# EAGLE design trans (EAGLE 5.00)
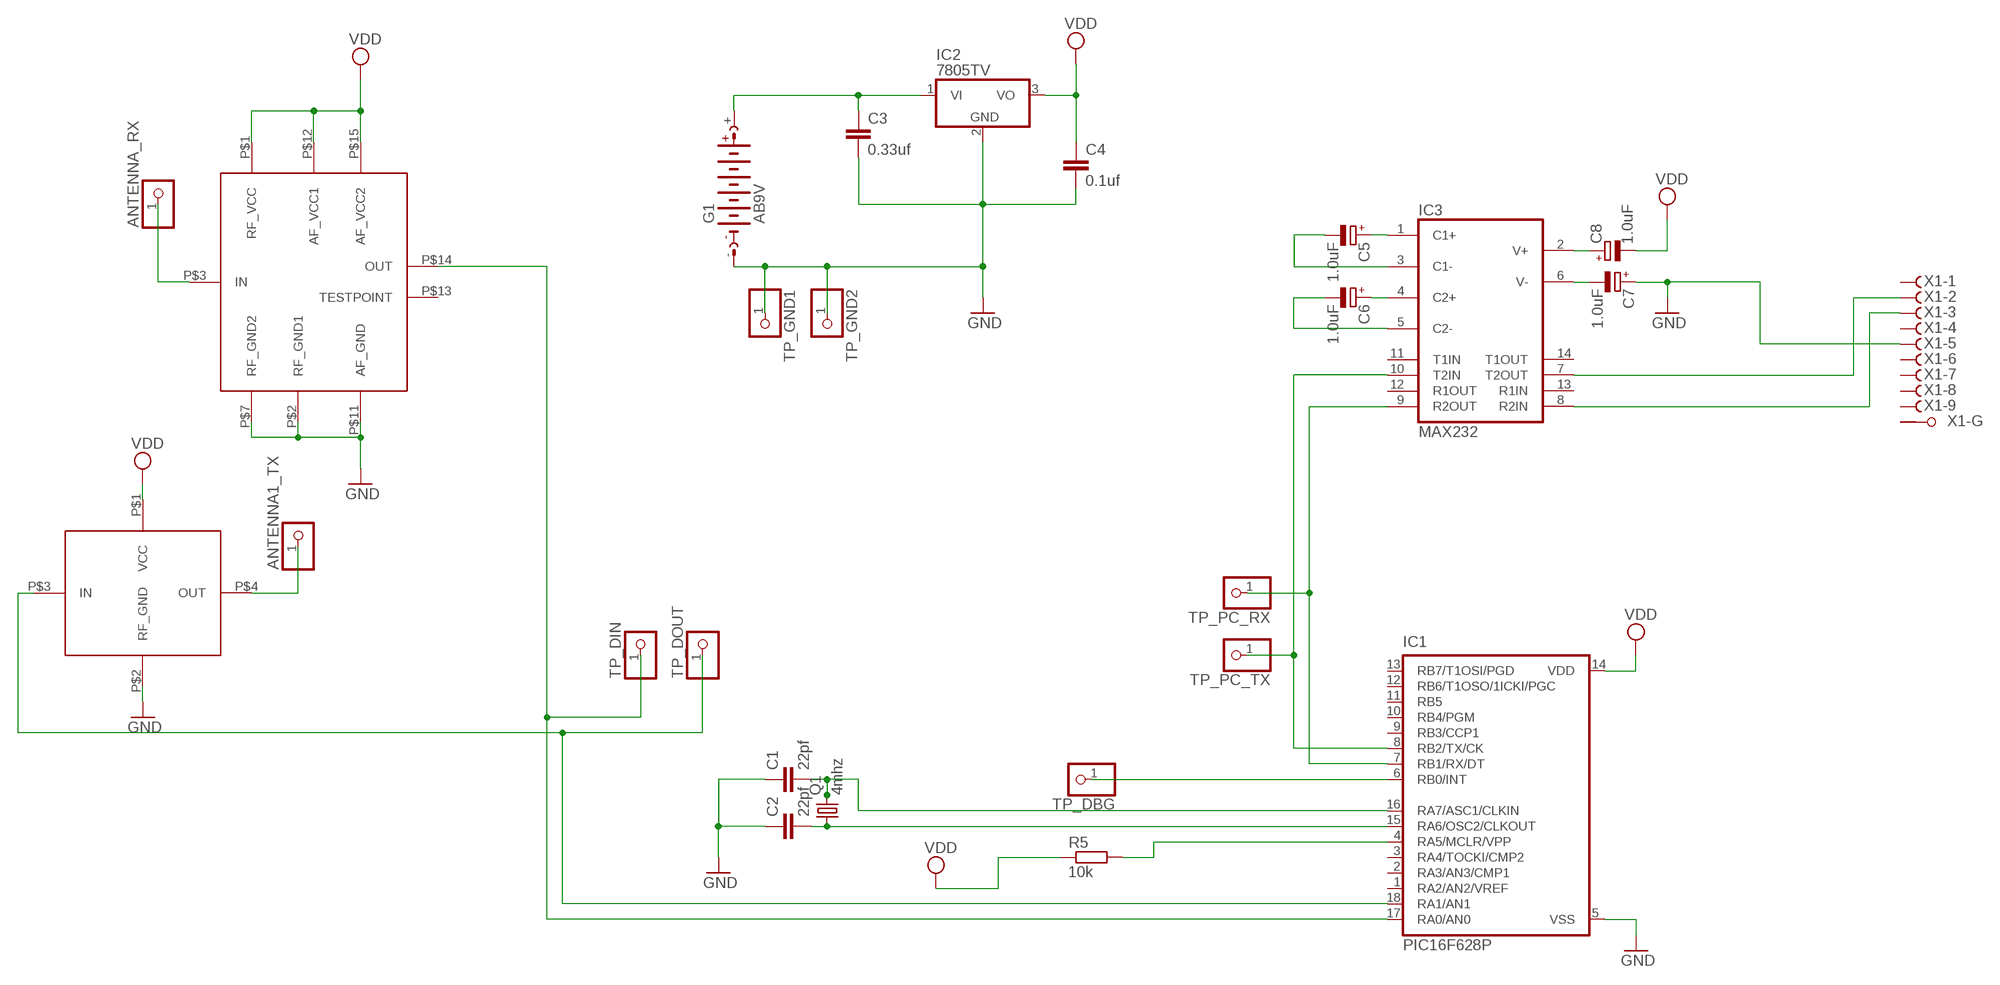
[diagram p0: schematic, sheet 1]

## Parts
ANTENNA1_TX  PINHD-1X1  [1X01]
ANTENNA_RX  PINHD-1X1  [1X01]
C1  22pf  C-EU075-032X103  [C075-032X103]
C2  22pf  C-EU075-032X103  [C075-032X103]
C3  0.33uf  C5/3  [C5B3]
C4  0.1uf  C5/3  [C5B3]
C5  1.0uF  CPOL-EUE2.5-7  [E2,5-7]
C6  1.0uF  CPOL-EUE2.5-7  [E2,5-7]
C7  1.0uF  CPOL-EUE2.5-7  [E2,5-7]
C8  1.0uF  CPOL-EUE2.5-7  [E2,5-7]
G1  AB9V  [AB9V]
IC1  PIC16F628P  [DIL18]
IC2  7805TV  [TO220V]
IC3  MAX232  [DIL16]
Q1  4mhz  CRYSTALHC49S  [HC49/S]
R5  10k  R-EU_0309/12  [0309/12]
TP_DBG  PINHD-1X1  [1X01]
TP_DIN  PINHD-1X1  [1X01]
TP_DOUT  PINHD-1X1  [1X01]
TP_GND1  PINHD-1X1  [1X01]
TP_GND2  PINHD-1X1  [1X01]
TP_PC_RX  PINHD-1X1  [1X01]
TP_PC_TX  PINHD-1X1  [1X01]
U$1  RR4  [SIL15]
U$2  RR5  [DIL4]
X1  F09HPS  [F09HP]

## Nets
9V: C3.1 G1.+ IC2.1(VI)
ANTENNA: ANTENNA_RX.1 U$1.P$3(IN)
GND: C1.1 C2.1 C3.2 C4.2 C7.+ G1.- IC1.5(VSS) IC2.2(GND) TP_GND1.1 TP_GND2.1 U$1.P$2(RF_GND1) U$1.P$7(RF_GND2) U$1.P$11(AF_GND) U$2.P$2(RF_GND) X1.5(-5:F)
N$1: C1.2 IC1.16(RA7/ASC1/CLKIN) Q1.2
N$2: C2.2 IC1.15(RA6/OSC2/CLKOUT) Q1.1
N$3: IC1.7(RB1/RX/DT) IC3.9(R2OUT) TP_PC_RX.1
N$4: IC1.8(RB2/TX/CK) IC3.10(T2IN) TP_PC_TX.1
N$5: C6.- IC3.5(C2-)
N$6: C6.+ IC3.4(C2+)
N$7: C5.+ IC3.1(C1+)
N$8: C5.- IC3.3(C1-)
N$9: IC1.4(RA5/MCLR/VPP) R5.2
N$10: C7.- IC3.6(V-)
N$11: C8.+ IC3.2(V+)
N$12: IC3.7(T2OUT) X1.2(-2:F)
N$13: IC1.17(RA0/AN0) TP_DIN.1 U$1.P$14(OUT)
N$14: IC1.6(RB0/INT) TP_DBG.1
N$15: ANTENNA1_TX.1 U$2.P$4(OUT)
N$16: IC1.18(RA1/AN1) TP_DOUT.1 U$2.P$3(IN)
N$17: IC3.8(R2IN) X1.3(-3:F)
VCC: C4.1 C8.- IC1.14(VDD) IC2.3(VO) R5.1 U$1.P$1(RF_VCC) U$1.P$12(AF_VCC1) U$1.P$15(AF_VCC2) U$2.P$1(VCC) ; supply symbol labelled VDD
Unconnected: IC1.1(RA2/AN2/VREF) IC1.2(RA3/AN3/CMP1) IC1.3(RA4/TOCKI/CMP2) IC1.9(RB3/CCP1) IC1.10(RB4/PGM) IC1.11(RB5) IC1.12(RB6/T1OSO/1ICKI/PGC) IC1.13(RB7/T1OSI/PGD) IC3.11(T1IN) IC3.12(R1OUT) IC3.13(R1IN) IC3.14(T1OUT) U$1.P$13(TESTPOINT) X1.1(-1:F) X1.4(-4:F) X1.6(-6:F) X1.7(-7:F) X1.8(-8:F) X1.9(-9:F) X1.G1(-G:G1) X1.G2(-G:G2)

## Power pins joined to a net without a drawn wire
GND: IC3.15(GND)
VCC: IC3.16(VCC)

## Library data of the parts
ANTENNA1_TX ANTENNA_RX TP_DBG TP_DIN TP_DOUT TP_GND1 TP_GND2 TP_PC_RX TP_PC_TX = pinhead:PINHD-1X1: PIN HEADER
C1 C2 = resistor:C-EU: CAPACITOR, European symbol
C3 C4 = capacitor-wima:C: CAPACITOR naming: grid - package width
C5-C8 = rcl:CPOL-EU: POLARIZED CAPACITOR, European symbol
G1 = battery:AB9V: 9-V BATTERY CLIP
IC1 = microchip:PIC16*F62: FLASH-Based 8-Bit CMOS Microcontroller Source: http://ww1.microchip.com/downloads/en/DeviceDoc/40300C.pdf
IC2 = linear:78*: Positive VOLTAGE REGULATOR Source: http://cache.national.com/ds/LM/LM78L05.pdf http://www.fairchildsemi.com/ds/LM/LM7805.pdf
IC3 = maxim:MAX232: RS232 TRANSEIVER
Q1 = crystal:CRYSTAL: CRYSTAL
R5 = rcl:R-EU_: RESISTOR, European symbol
U$1 = rf:RR4
U$2 = rf:RR5
X1 = con-subd:F09HPS: SUB-D

## Board
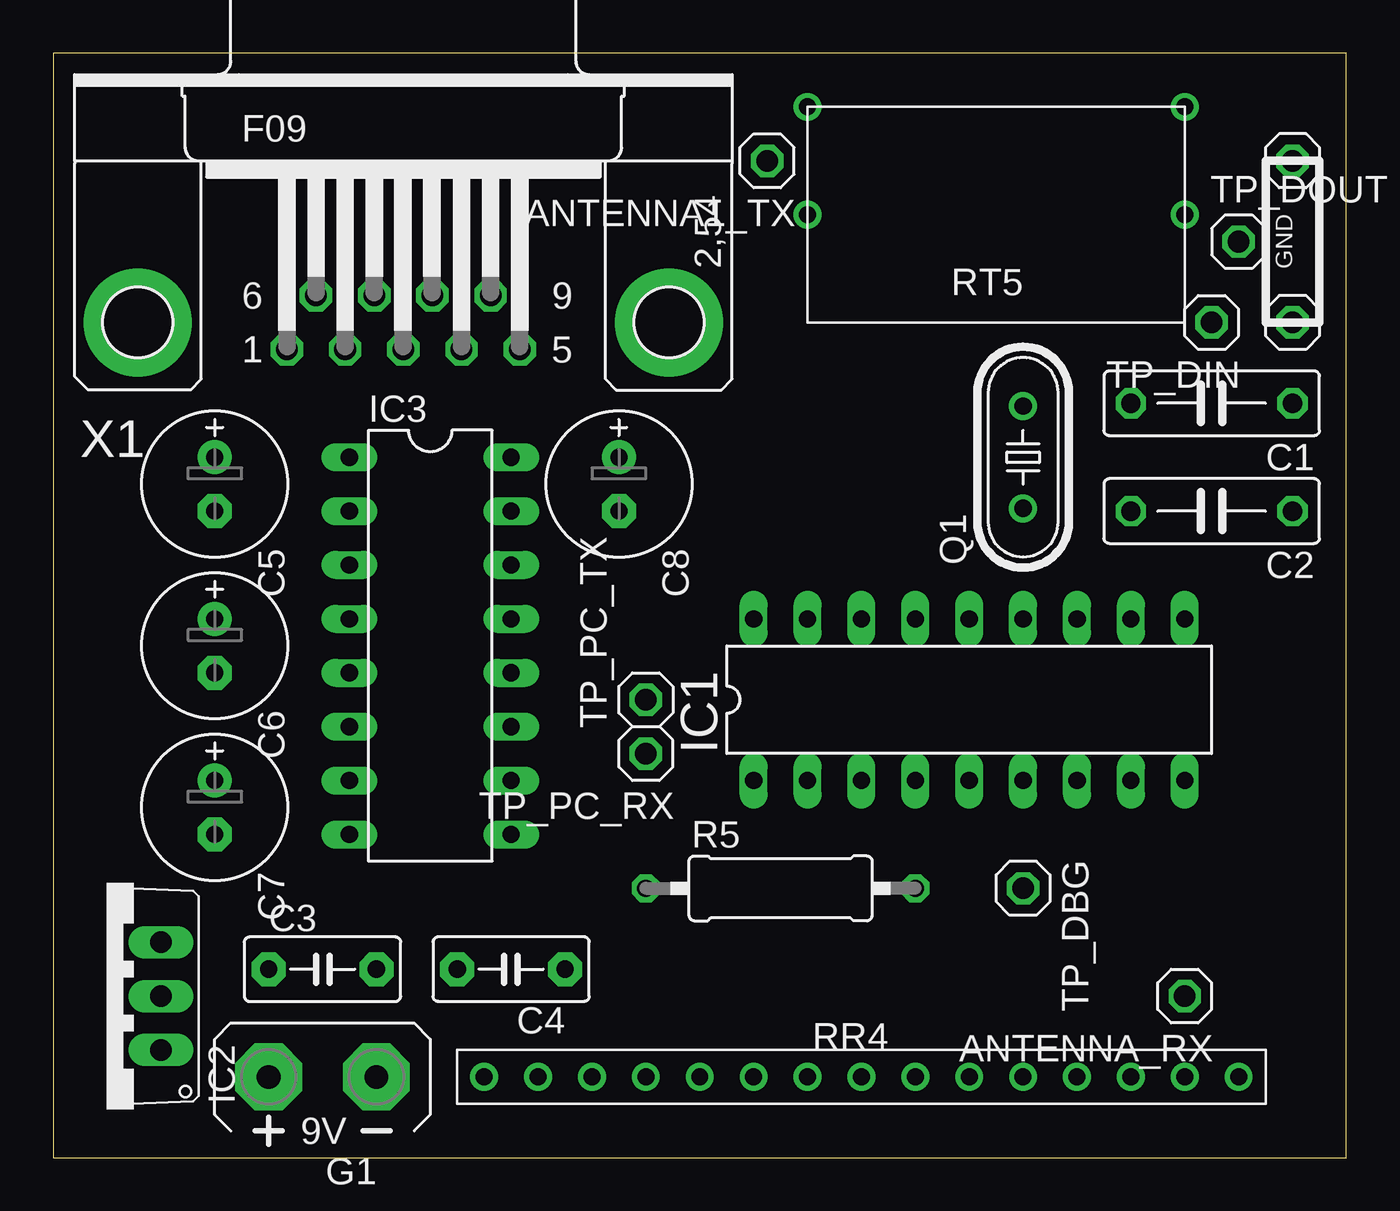
[diagram p1: board, top side]
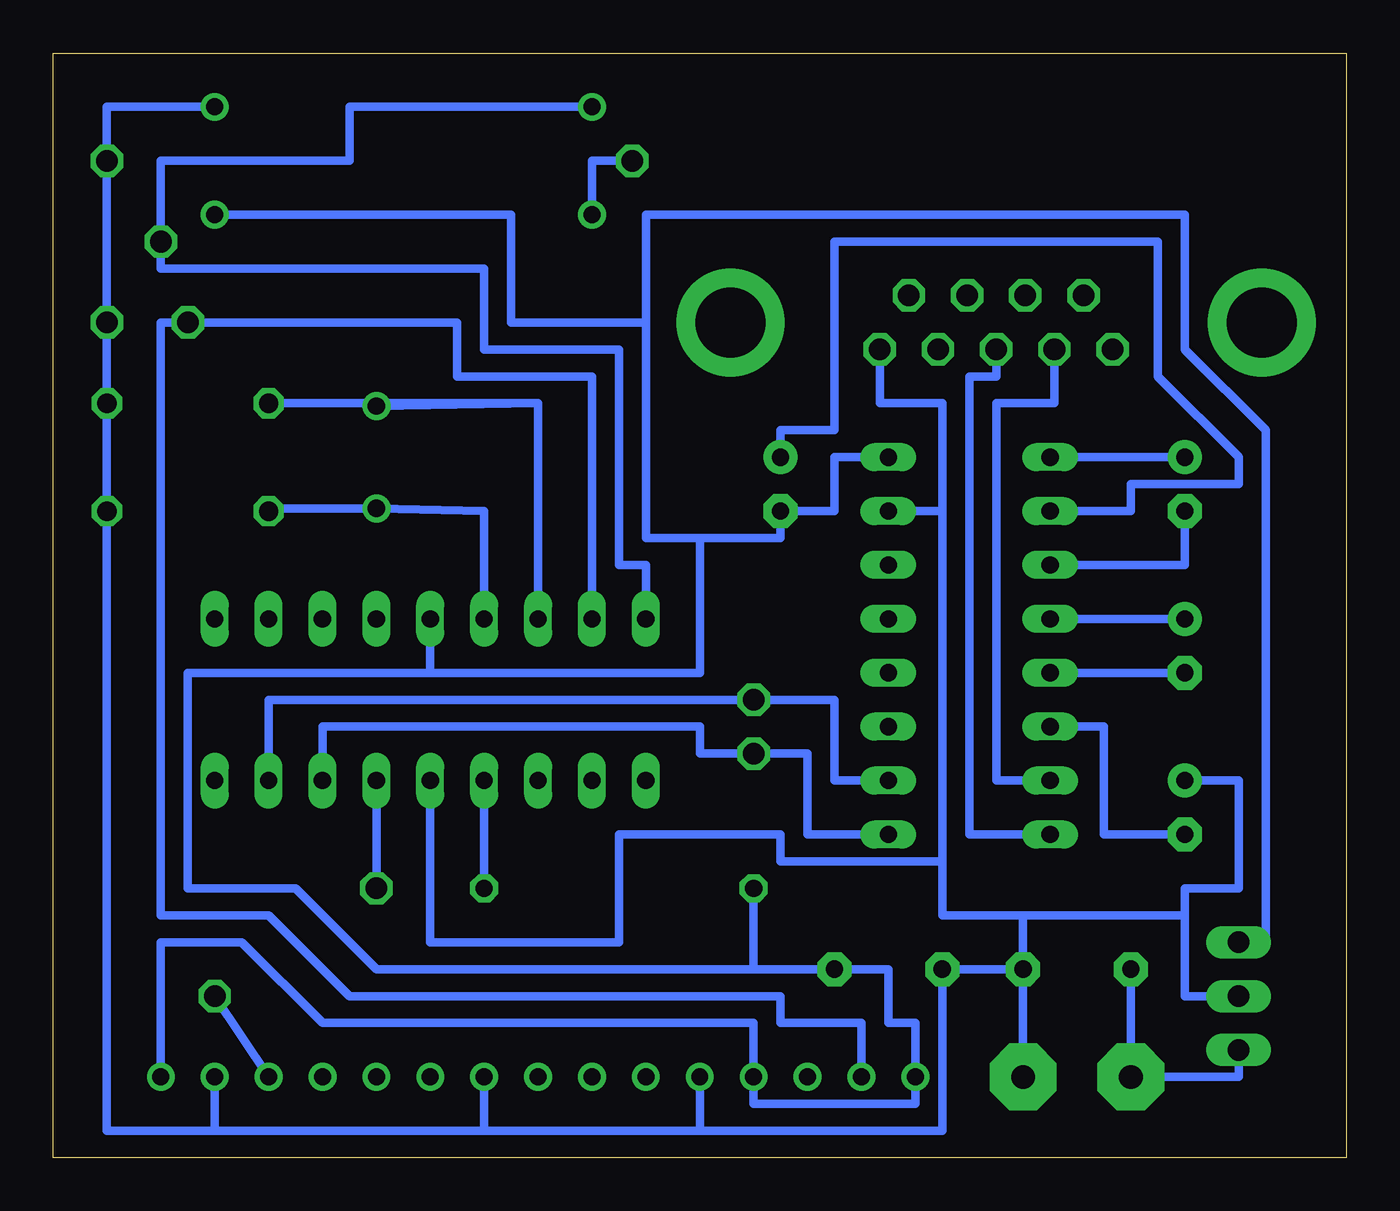
[diagram p2: board, bottom side, seen from below]

Size 60.96 x 52.07 mm. Coordinates in mm from the lower left corner, seen from the top.
Outline: 0,0 60.96,0 60.96,52.07 0,52.07 0,0
Copper layers (1*16): Top 0.035mm / dielectric 1.5mm / Bottom 0.035mm
Design rules "default": minimum track width 10mil, minimum drill 24mil, track to track 8mil, track to pad 8mil, pad to pad 8mil, via to via 8mil, smd to smd 8mil, copper to edge 40mil, drill to drill 8mil, minimum pad ring 10mil, minimum via ring 8mil, stop-mask expansion 4mil, vias tented up to drill 0mil, thermal gap 10mil

### Footprints (pad centres in the part's own frame; a part is rotated, then mirrored left to right if it is on the bottom)
1X01 = drill 1.016 octagon: 1 0,0
C075-032X103 = drill 0.914 octagon: 1 -3.81,0; 2 3.81,0
C5B3 = drill 0.813 pad 1.6 octagon: 1 -2.54,0; 2 2.54,0
E2,5-7 = drill 0.813 pad 1.6 round: + -1.27,0 | drill 0.813 pad 1.6 octagon: - 1.27,0
AB9V = drill 1.118 pad 3.15 octagon: + 0,2.54; - 0,-2.54
DIL18 = drill 0.813 long: 1 -10.16,-3.81; 2 -7.62,-3.81; 3 -5.08,-3.81; 4 -2.54,-3.81; 5 0,-3.81; 6 2.54,-3.81; 7 5.08,-3.81; 8 7.62,-3.81; 9 10.16,-3.81; 10 10.16,3.81; 11 7.62,3.81; 12 5.08,3.81; 13 2.54,3.81; 14 0,3.81; 15 -2.54,3.81; 16 -5.08,3.81; 17 -7.62,3.81; 18 -10.16,3.81
TO220V = drill 1.016 long: 1 -2.54,-2.54; 2 0,-2.54; 3 2.54,-2.54
DIL16 = drill 0.813 long: 1 -8.89,-3.81; 2 -6.35,-3.81; 3 -3.81,-3.81; 4 -1.27,-3.81; 5 1.27,-3.81; 6 3.81,-3.81; 7 6.35,-3.81; 8 8.89,-3.81; 9 8.89,3.81; 10 6.35,3.81; 11 3.81,3.81; 12 1.27,3.81; 13 -1.27,3.81; 14 -3.81,3.81; 15 -6.35,3.81; 16 -8.89,3.81
HC49/S = drill 0.813 round: 1 -2.413,0; 2 2.413,0
0309/12 = drill 0.813 octagon: 1 -6.35,0; 2 6.35,0
SIL15 = drill 0.8 round: P$1 -17.78,0; P$2 -15.24,0; P$3 -12.7,0; P$4 -10.16,0; P$5 -7.62,0; P$6 -5.08,0; P$7 -2.54,0; P$8 0,0; P$9 2.54,0; P$10 5.08,0; P$11 7.62,0; P$12 10.16,0; P$13 12.7,0; P$14 15.24,0; P$15 17.78,0
DIL4 = drill 0.8 round: P$1 -8.89,0; P$2 -8.89,-5.08; P$3 8.89,-5.08; P$4 8.89,0
F09HP = drill 1.016 octagon: 1 -5.486,-1.27; 2 -2.743,-1.27; 3 0,-1.27; 4 2.743,-1.27; 5 5.486,-1.27; 6 -4.115,1.27; 7 -1.372,1.27; 8 1.372,1.27; 9 4.115,1.27 | drill 3.302 pad 5.08 round: G1 -12.522,0; G2 12.522,0

### Placement (x,y rotation side)
ANTENNA1_TX  33.66,46.99 180 top
ANTENNA_RX  53.34,7.62 180 top
C1  54.61,35.56 180 top
C2  54.61,30.48 180 top
C3  12.7,8.89 0 top
C4  21.59,8.89 180 top
C5  7.62,31.75 270 top
C6  7.62,24.13 270 top
C7  7.62,16.51 270 top
C8  26.67,31.75 270 top
G1  12.7,3.81 90 top
IC1  43.18,21.59 0 top
IC2  2.54,7.62 90 top
IC3  17.78,24.13 270 top
Q1  45.72,33.02 90 top
R5  34.29,12.7 0 top
TP_DBG  45.72,12.7 270 top
TP_DIN  54.61,39.37 180 top
TP_DOUT  55.88,43.18 0 top
TP_GND1  58.42,39.37 270 top
TP_GND2  58.42,46.99 270 top
TP_PC_RX  27.94,19.05 180 top
TP_PC_TX  27.94,21.59 90 top
U$1  38.1,3.81 180 top
U$2  44.45,44.45 180 top
X1  16.51,39.37 0 top

### Tracks (layer width: path | path; a pad name or v marks a point on that pad's centre or on a via)
9V
  Bottom 0.406: IC2.1 5.08,3.81 G1.+ C3.1
ANTENNA
  Bottom 0.406: U$1.P$3 ANTENNA_RX.1
GND
  Bottom 0.406: IC2.2 7.62,7.62 7.62,11.43 | 7.62,11.43 15.24,11.43 | 15.24,11.43 C3.2 | C3.2 G1.- | C3.2 C4.2 19.05,1.27 30.48,1.27 | U$2.P$2 58.42,49.53 TP_GND2.1 TP_GND1.1 C1.1 C2.1 58.42,1.27 53.34,1.27 | 30.48,1.27 U$1.P$11 | 40.64,1.27 U$1.P$7 | 30.48,1.27 40.64,1.27 | 53.34,1.27 U$1.P$2 | 40.64,1.27 53.34,1.27 | X1.5 22,35.56 19.05,35.56 19.05,30.48 | 19.05,30.48 IC3.15 | 7.62,11.43 7.62,12.7 5.08,12.7 5.08,17.78 C7.+ | 19.05,13.97 19.05,11.43 15.24,11.43 | 19.05,13.97 19.05,30.48 | IC1.5 43.18,10.16 34.29,10.16 34.29,15.24 26.67,15.24 26.67,13.97 19.05,13.97
N$1
  Bottom 0.406: IC1.16 38.1,35.56 | 38.1,35.56 Q1.2 | 38.1,35.56 C1.2
N$2
  Bottom 0.406: C2.2 50.8,30.61 Q1.1 40.64,30.48 IC1.15
N$3
  Bottom 0.406: IC1.7 48.26,20.32 30.48,20.32 30.48,19.05 TP_PC_RX.1 25.4,19.05 25.4,15.24 IC3.9
N$4
  Bottom 0.406: IC1.8 50.8,21.59 TP_PC_TX.1 24.13,21.59 24.13,17.78 IC3.10
N$5
  Bottom 0.406: C6.- IC3.5
N$6
  Bottom 0.406: C6.+ IC3.4
N$7
  Bottom 0.406: C5.+ IC3.1
N$8
  Bottom 0.406: IC3.3 7.62,27.94 C5.-
N$9
  Bottom 0.406: IC1.4 R5.2
N$10
  Bottom 0.406: C7.- 11.43,15.24 11.43,20.32 IC3.6
N$11
  Bottom 0.406: C8.+ 26.67,34.29 24.13,34.29 24.13,43.18 8.89,43.18 8.89,36.83 5.08,33.02 5.08,31.75 10.16,31.75 10.16,30.48 IC3.2
N$12
  Bottom 0.406: X1.2 13.77,35.56 16.51,35.56 16.51,17.78 IC3.7
N$13
  Bottom 0.406: U$1.P$14 22.86,6.35 26.67,6.35 26.67,7.62 46.99,7.62 50.8,11.43 55.88,11.43 55.88,39.37 TP_DIN.1 41.91,39.37 41.91,36.83 35.56,36.83 IC1.17
N$14
  Bottom 0.406: TP_DBG.1 IC1.6
N$15
  Bottom 0.406: ANTENNA1_TX.1 35.56,46.99 U$2.P$4
N$16
  Bottom 0.406: U$2.P$3 46.99,49.53 46.99,46.99 55.88,46.99 TP_DOUT.1 55.88,41.91 40.64,41.91 40.64,38.1 34.29,38.1 34.29,27.94 33.02,27.94 IC1.18
N$17
  Bottom 0.406: X1.3 16.51,36.83 17.78,36.83 17.78,15.24 IC3.8
VCC
  Bottom 0.406: U$2.P$1 39.37,44.45 39.37,39.37 33.02,39.37 | 30.48,29.21 30.48,22.86 | 30.48,29.21 33.02,29.21 33.02,39.37 | 30.48,22.86 43.18,22.86 IC1.14 | U$1.P$1 55.88,10.16 52.07,10.16 | 52.07,10.16 48.26,6.35 27.94,6.35 U$1.P$12 27.94,2.54 20.32,2.54 U$1.P$15 20.32,6.35 21.59,6.35 21.59,8.89 C4.1 27.94,8.89 | 52.07,10.16 53.34,10.16 | 30.48,29.21 26.67,29.21 C8.- 24.13,30.48 24.13,33.02 IC3.16 | IC2.3 3.81,10.16 3.81,34.29 7.62,38.1 7.62,44.45 33.02,44.45 33.02,39.37 | 30.48,22.86 54.61,22.86 54.61,12.7 49.53,12.7 45.72,8.89 27.94,8.89 | 27.94,8.89 R5.1

### Text on the board
tNames: GND